# Altium schematic sheet Deneigus_Controle_Deplacement.SchDoc
size Tabloid; Date: Date; Author: Author 1; Revision: 1; Size: 11x17; Sheet_Name: Interface Déplacement
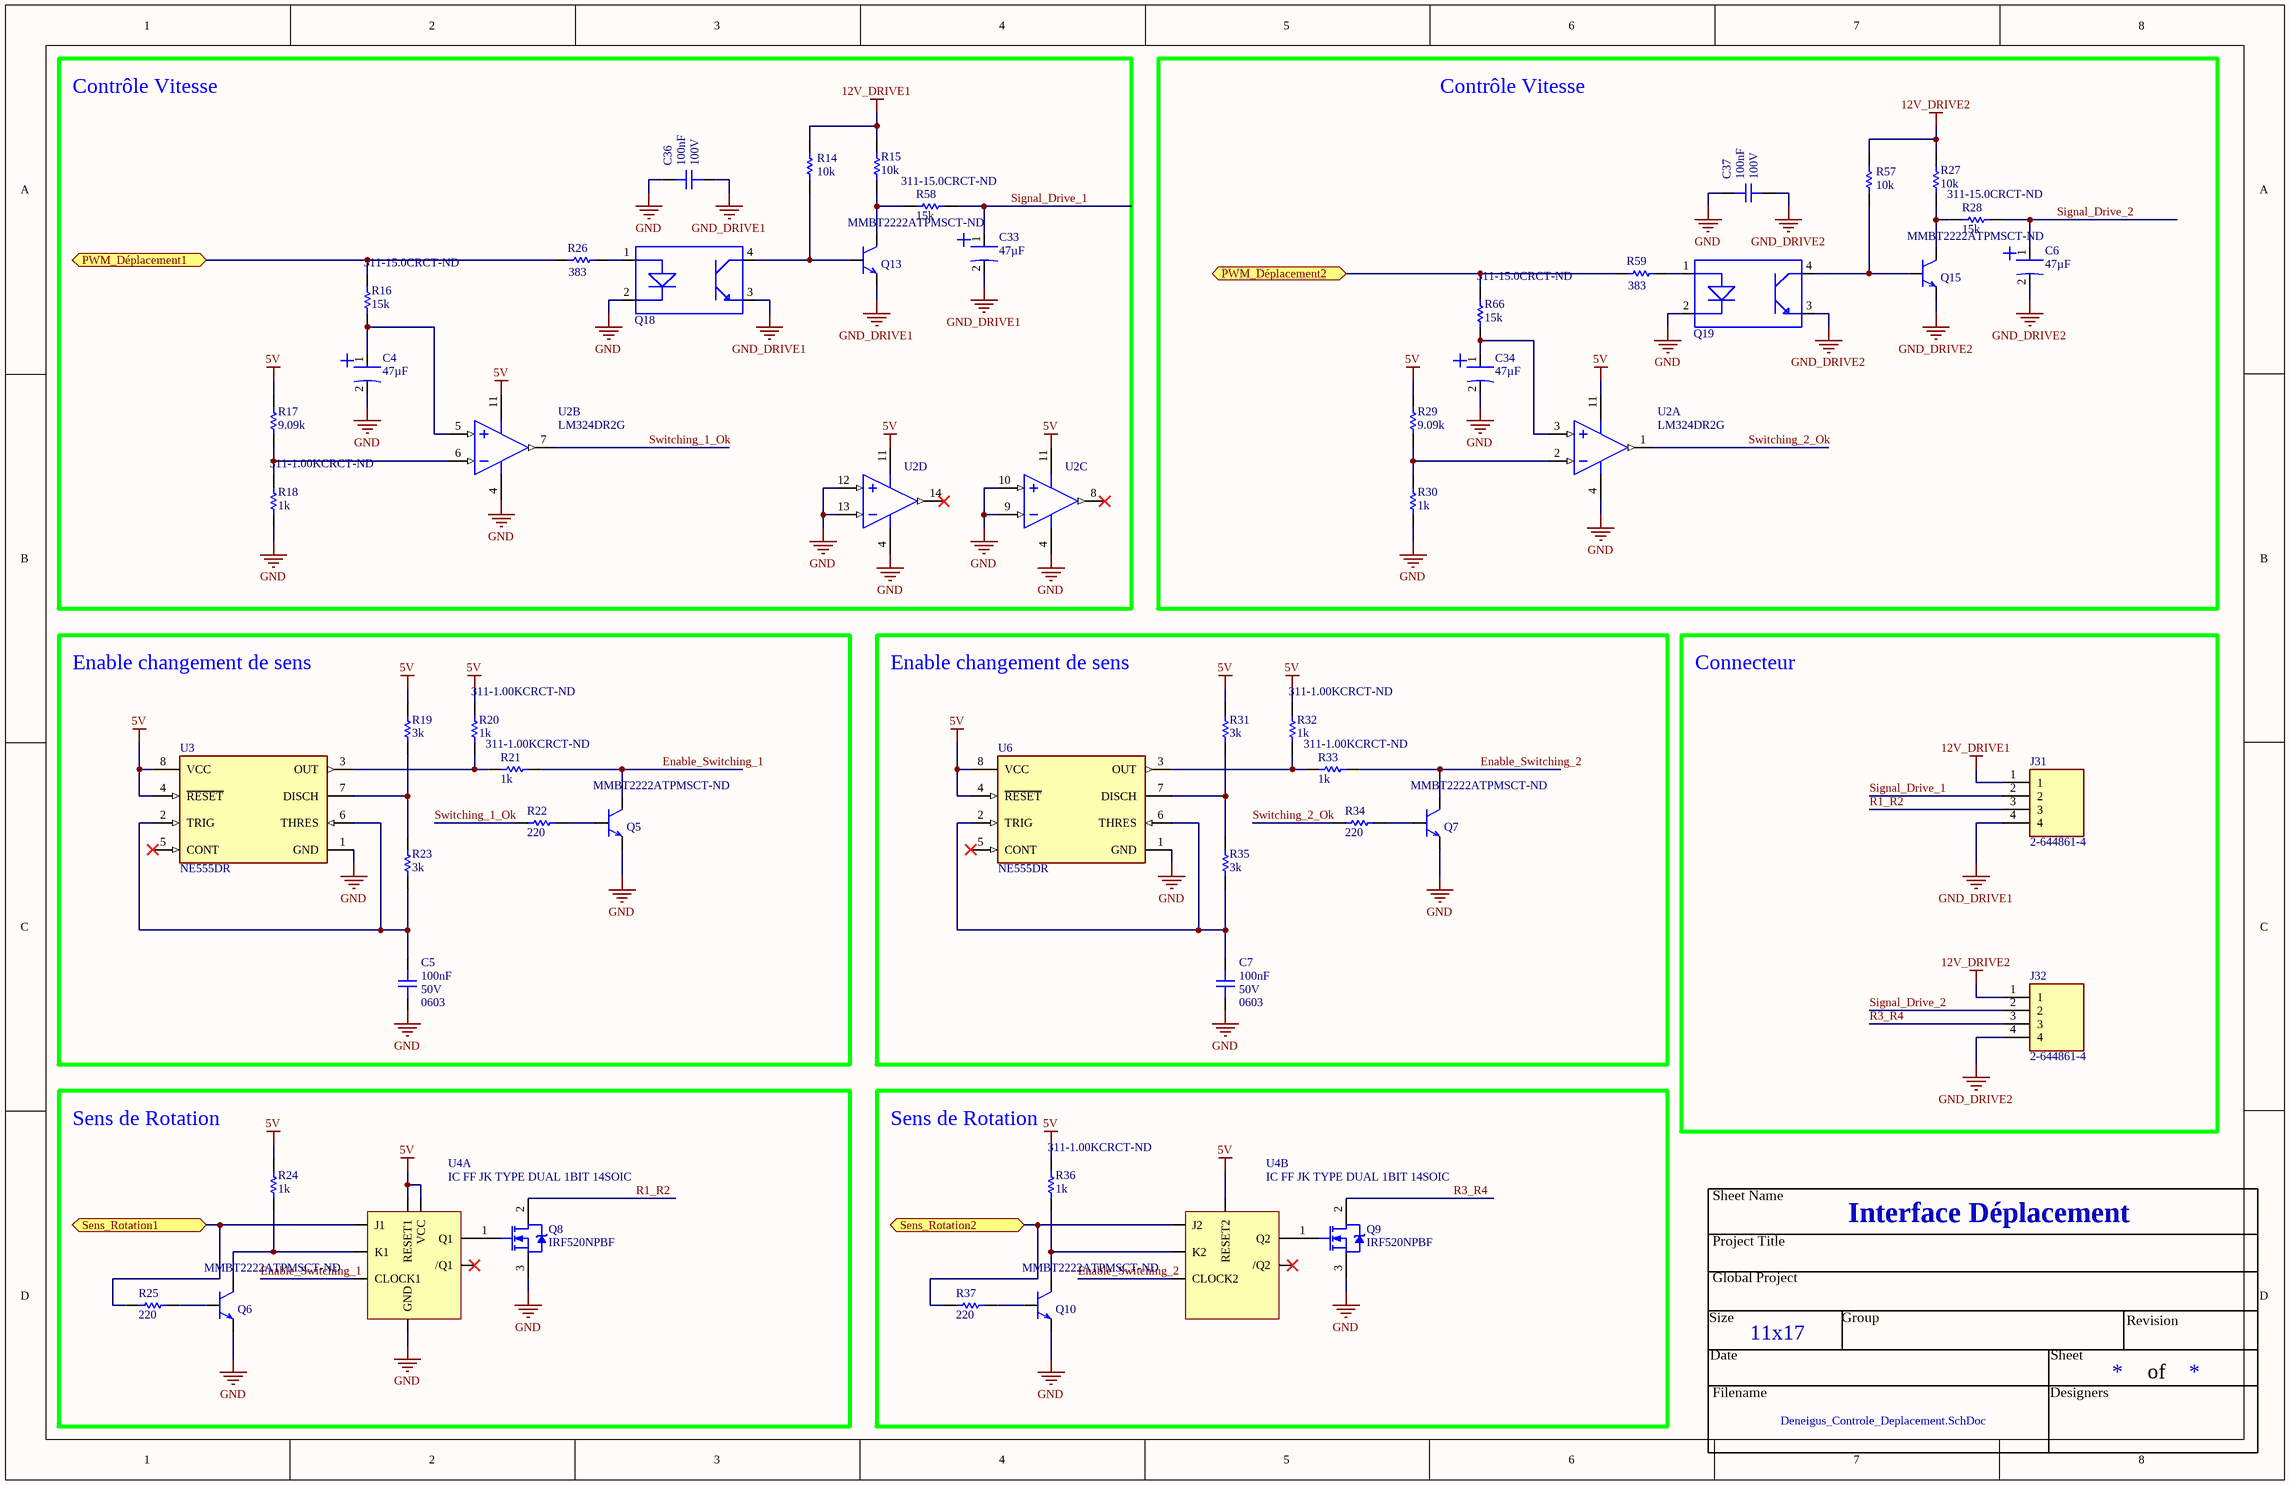
[diagram p0: Deneigus_Controle_Deplacement.SchDoc]

## Parts
C4  value 47µF  [47uF]  (hidden comment: CAP ALUM POLY 47UF 20% 16V SMD)
C5  value 100nF  Voltage: 50V  Package: 0603  [CAP_0603]  (hidden comment: CAP - 0603)
C6  value 47µF  [47uF]  (hidden comment: CAP ALUM POLY 47UF 20% 16V SMD)
C7  value 100nF  Voltage: 50V  Package: 0603  [CAP_0603]  (hidden comment: CAP - 0603)
C33  value 47µF  [47uF]  (hidden comment: CAP ALUM POLY 47UF 20% 16V SMD)
C34  value 47µF  [47uF]  (hidden comment: CAP ALUM POLY 47UF 20% 16V SMD)
C36  value 100nF  Voltage: 100V  [CAP_0805]  (hidden comment: CAP - 0805)
C37  value 100nF  Voltage: 100V  [CAP_0805]  (hidden comment: CAP - 0805)
J31  2-644861-4  [TE_2-644861-4]
J32  2-644861-4  [TE_2-644861-4]
Q5  Supplier Part Number 1: MMBT2222ATPMSCT-ND  [SOT-23]  (hidden comment: TRANS NPN 40V 0.2A SOT23)
Q6  Supplier Part Number 1: MMBT2222ATPMSCT-ND  [SOT-23]  (hidden comment: TRANS NPN 40V 0.2A SOT23)
Q7  Supplier Part Number 1: MMBT2222ATPMSCT-ND  [SOT-23]  (hidden comment: TRANS NPN 40V 0.2A SOT23)
Q8  IRF520NPBF  [INTR-TO-220AB-3]
Q9  IRF520NPBF  [INTR-TO-220AB-3]
Q10  Supplier Part Number 1: MMBT2222ATPMSCT-ND  [SOT-23]  (hidden comment: TRANS NPN 40V 0.2A SOT23)
Q13  Supplier Part Number 1: MMBT2222ATPMSCT-ND  [SOT-23]  (hidden comment: TRANS NPN 40V 0.2A SOT23)
Q15  Supplier Part Number 1: MMBT2222ATPMSCT-ND  [SOT-23]  (hidden comment: TRANS NPN 40V 0.2A SOT23)
Q18  WL-OCPT OPTOCOUPLER PHOTOTRANSIS  [WL-OCPT OPTOCOUPLER PHOTOTRANSIS]  (value not drawn)
Q19  WL-OCPT OPTOCOUPLER PHOTOTRANSIS  [WL-OCPT OPTOCOUPLER PHOTOTRANSIS]  (value not drawn)
R14  value 10k  [RES_0805]  (hidden comment: Res1)
R15  value 10k  [RES_0805]  (hidden comment: Res1)
R16  value 15k  Supplier Part Number 1: 311-15.0CRCT-ND  [RES_0805]  (hidden comment: Res1)
R17  value 9.09k  [RES_0805]  (hidden comment: Res1)
R18  value 1k  Supplier Part Number 1: 311-1.00KCRCT-ND  [RES_0805]  (hidden comment: Res1)
R19  value 3k  [RES_0805]  (hidden comment: Res1)
R20  value 1k  Supplier Part Number 1: 311-1.00KCRCT-ND  [RES_0805]  (hidden comment: Res1)
R21  value 1k  Supplier Part Number 1: 311-1.00KCRCT-ND  [RES_0805]  (hidden comment: Res1)
R22  value 220  [RES_0805]  (hidden comment: Res1)
R23  value 3k  [RES_0805]  (hidden comment: Res1)
R24  value 1k  [RES_0805]  (hidden comment: Res1)
R25  value 220  [RES_0805]  (hidden comment: Res1)
R26  value 383  [RES_0805]  (hidden comment: Res1)
R27  value 10k  [RES_0805]  (hidden comment: Res1)
R28  value 15k  Supplier Part Number 1: 311-15.0CRCT-ND  [RES_0805]  (hidden comment: Res1)
R29  value 9.09k  [RES_0805]  (hidden comment: Res1)
R30  value 1k  [RES_0805]  (hidden comment: Res1)
R31  value 3k  [RES_0805]  (hidden comment: Res1)
R32  value 1k  Supplier Part Number 1: 311-1.00KCRCT-ND  [RES_0805]  (hidden comment: Res1)
R33  value 1k  Supplier Part Number 1: 311-1.00KCRCT-ND  [RES_0805]  (hidden comment: Res1)
R34  value 220  [RES_0805]  (hidden comment: Res1)
R35  value 3k  [RES_0805]  (hidden comment: Res1)
R36  value 1k  Supplier Part Number 1: 311-1.00KCRCT-ND  [RES_0805]  (hidden comment: Res1)
R37  value 220  [RES_0805]  (hidden comment: Res1)
R57  value 10k  [RES_0805]  (hidden comment: Res1)
R58  value 15k  Supplier Part Number 1: 311-15.0CRCT-ND  [RES_0805]  (hidden comment: Res1)
R59  value 383  [RES_0805]  (hidden comment: Res1)
R66  value 15k  Supplier Part Number 1: 311-15.0CRCT-ND  [RES_0805]  (hidden comment: Res1)
U2  LM324DR2G  [ONSC-SOIC-14-751A-03_V]  (parts A,B,C,D of 4)
U3  NE555DR  [FP-D0008A-IPC_A]
U4  IC FF JK TYPE DUAL 1BIT 14SOIC  [SOIC127P600X175-14N]  (parts A,B of 2)
U6  NE555DR  [FP-D0008A-IPC_A]

## Blocks framed on the sheet
Contrôle Vitesse: C4 C33 C36 Q13 Q18 R14-R18 R26 R58 U2
Contrôle Vitesse: C6 C34 C37 Q15 Q19 R27-R30 R57 R59 R66 U2
Enable changement de sens: C5 Q5 R19-R23 U3
Enable changement de sens: C7 Q7 R31-R35 U6
Connecteur: J31 J32
Sens de Rotation: Q6 Q8 R24 R25 U4
Sens de Rotation: Q9 Q10 R36 R37 U4

## Ports
PWM_Déplacement1 (bidir), PWM_Déplacement2 (bidir), Sens_Rotation1 (bidir), Sens_Rotation2 (bidir)

## Nets
5V: R17.2 R19.2 R20.2 R24.2 R29.2 R31.2 R32.2 R36.2 U2.11(VEE/GND) U3.4(~{RESET}) U3.8(VCC) U4.2(RESET1) U4.4(VCC) U4.6(RESET2) U6.4(~{RESET}) U6.8(VCC)
12V_DRIVE1: J31.1 R14.1 R15.2
12V_DRIVE2: J32.1 R27.2 R57.1
GND: C4.2 C5.1 C7.1 C34.2 C36.2 C37.2 Q5.2 Q6.2 Q7.2 Q8.3(S) Q9.3(S) Q10.2 Q18.2 Q19.2 R18.1 R30.1 U2.4(VCC) U2.9(IN3-) U2.10(IN3+) U2.12(IN4+) U2.13(IN4-) U3.1(GND) U4.11(GND) U6.1(GND)
GND_DRIVE1: C33.2 C36.1 J31.4 Q13.2 Q18.3
GND_DRIVE2: C6.2 C37.1 J32.4 Q15.2 Q19.3
Enable_Switching_1: Q5.3 R21.2 U4.1(CLOCK1)
Enable_Switching_2: Q7.3 R33.2 U4.5(CLOCK2)
PWM_Déplacement1: R16.1 R26.1 ; port PWM_Déplacement1
PWM_Déplacement2: R59.1 R66.1 ; port PWM_Déplacement2
R1_R2: J31.3 Q8.2(D)
R3_R4: J32.3 Q9.2(D)
Sens_Rotation1: R25.1 U4.14(J1) ; port Sens_Rotation1
Sens_Rotation2: R37.1 U4.7(J2) ; port Sens_Rotation2
Signal_Drive_1: C33.1 J31.2 R58.2
Signal_Drive_2: C6.1 J32.2 R28.2
Switching_1_Ok: R22.1 U2.7(OUT2)
Switching_2_Ok: R34.1 U2.1(OUT1)
NetC4_1: C4.1 R16.2 U2.5(IN2+)
NetC5_2: C5.2 R23.1 U3.2(TRIG) U3.6(THRES)
NetC7_2: C7.2 R35.1 U6.2(TRIG) U6.6(THRES)
NetC34_1: C34.1 R66.2 U2.3(IN1+)
NetQ5_1: Q5.1 R22.2
NetQ6_1: Q6.1 R25.2
NetQ6_3: Q6.3 R24.1 U4.3(K1)
NetQ7_1: Q7.1 R34.2
NetQ8_1: Q8.1(G) U4.12(Q1)
NetQ9_1: Q9.1(G) U4.9(Q2)
NetQ10_1: Q10.1 R37.2
NetQ10_3: Q10.3 R36.1 U4.10(K2)
NetQ13_1: Q13.1 Q18.4 R14.2
NetQ13_3: Q13.3 R15.1 R58.1
NetQ15_1: Q15.1 Q19.4 R57.2
NetQ15_3: Q15.3 R27.1 R28.1
NetQ18_1: Q18.1 R26.2
NetQ19_1: Q19.1 R59.2
NetR17_1: R17.1 R18.2 U2.6(IN2-)
NetR19_1: R19.1 R23.2 U3.7(DISCH)
NetR20_1: R20.1 R21.1 U3.3(OUT)
NetR29_1: R29.1 R30.2 U2.2(IN1-)
NetR31_1: R31.1 R35.2 U6.7(DISCH)
NetR32_1: R32.1 R33.1 U6.3(OUT)

Not connected (* = marked no-connect by the designer): U2 8(OUT3)* 14(OUT4)*; U3 5(CONT)*; U4 8(/Q2)* 13(/Q1)*; U6 5(CONT)*

## Notes on the sheet
- Sheet Name
- Project Title
- Global Project
- Revision
- Size
- Date
- Group
- Sheet
- of
- Filename
- Designers

## Library data of the parts
C4 C6 C33 C34 = 47µF SMD: Mfg Part Number: 875105344006; Mfg: Würth Elektronik; Supplier 1: Digikey; Supplier Part Number 1: 732-6421-2-ND; HelpURL: https://www.we-online.de/katalog/datasheet/875105344006.pdf
C5 C7 = CAP - 0603: Precision: 10%; Current: *; CreatedBy: Jonathan Bouchard; Power: *
C36 C37 = CAP - 0805: Mfg Part Number: GRM21BR61H106ME43L; Mfg: Murata Electronics; Precision: 10%; Current: *; CreatedBy: Jonathan Bouchard; Power: *; Package: 0805; Supplier 1: Digi-Key; Supplier Part Number 1: 490-5825-1-ND
J31 J32 = 2-644861-4: Connector Header Through Hole 4 position 0.100 (2.54mm); MF: TE Connectivity; Availability: Good; Value: *; Check_prices: https://www.snapeda.com/parts/2-644861-4/TE%20Connectivity%20AMP%20Connectors/view-part/2876279/?ref=eda; Package: None; Price: None; MP: 2-644861-4; SnapEDA_Link: https://www.snapeda.com/parts/2-644861-4/TE%20Connectivity%20AMP%20Connectors/view-part/2876279/?ref=snap; Purchase-URL: https://pricing.snapeda.com/search/part/2-644861-4/?ref=eda
Q5-Q7 Q10 Q13 Q15 = NPN 3904 SMD: Transistor: 200mA 200mW NPN General-Purpose Amplifier, SOT-23, 7IN. Reel; Manufacturer: MCC; Manufacturer Part Number: MMBT3904-TP; Max Power Dissipation: 350mW; Number of Elements: 1; hFE Min: 40; Frequency: 300MHz; Collector Base Voltage (VCBO): 60V; Emitter Base Voltage (VEBO): 6V; Collector Emitter Saturation Voltage: 300mV; Element Configuration: Single; Current Rating: 100mA; RoHS: Yes; Category: BJTs; Stock 1: 949449; Pricing 1: 1=0.10000, 10=0.08100, 25=0.07680, 100=0.04400, 500=0.02706, 1000=0.01844 (USD); Mount: Surface Mount; Case/Package: SOT-23; Number of Pins: 3; Min Operating Temperature: -55°C; Max Operating Temperature: 150°C; Package Quantity: 1; Collector Emitter Voltage (VCEO): 40V; Packaging: Tape and Reel; Max Collector Current: 200mA; Transition Frequency: 300MHz; Collector Emitter Breakdown Voltage: 40V; Polarity: NPN; Max Breakdown Voltage: 40V; Power Dissipation: 350mW; Max Frequency: 300MHz; Gain Bandwidth Product: 300MHz; Voltage Rating (DC): 40V; Series: -; Collector-emitter Voltage-Max: 300mV; Length: 3.04mm; Width: 1.4mm; Height: 1.12mm; Radiation Hardening: No; Lead Free: Lead Free; RoHS Compliant: Yes; ComponentLink1URL: https://datasheet.ciiva.com/972/mmbt3904sot-23-972515.pdf?src-supplier=Digi-Key; ComponentLink1Description: https://datasheet.ciiva.com/972/mmbt3904sot-23-972515.pdf?src-supplier=Digi-Key; ComponentLink2URL: https://datasheet.ciiva.com/16291/mmbt3904sot-23-37005-16291911.pdf?src-supplier=Mouser; ComponentLink2Description: https://datasheet.ciiva.com/16291/mmbt3904sot-23-37005-16291911.pdf?src-supplier=Mouser; ComponentLink3URL: https://datasheet.ciiva.com/15139/getdatasheetpartid-251950-15139820.pdf?src-supplier=Verical; ComponentLink3Description: https://datasheet.ciiva.com/15139/getdatasheetpartid-251950-15139820.pdf?src-supplier=Verical; ComponentLink4URL: https://datasheet.ciiva.com/972/mmbt3904sot-23-972516.pdf?src-supplier=Digi-Key; ComponentLink4Description: https://datasheet.ciiva.com/972/mmbt3904sot-23-972516.pdf?src-supplier=Digi-Key; ComponentLink5URL: https://datasheet.ciiva.com/16742/mmbt3904tsot-523-16742101.pdf?src-supplier=Future+Electronics; ComponentLink5Description: https://datasheet.ciiva.com/16742/mmbt3904tsot-523-16742101.pdf?src-supplier=Future+Electronics; ComponentLink6URL: https://datasheet.ciiva.com/14546/70055699-14546053.pdf?src-supplier=Allied+Electronics; ComponentLink6Description: https://datasheet.ciiva.com/14546/70055699-14546053.pdf?src-supplier=Allied+Electronics; Supplier 1: Digi-Key
Q8 Q9 = CMP-013-00017-4: HEXFET(R) Power MOSFET, 100 V, 9.7 A, 0.2 Ohm, -55 to 175 degC, 3-Pin FM (TO-220AB), RoHS, Tube; Manufacturer: International Rectifier; Power: 48W; Elements: 1; Typical Rise Time: 23ns; Nominal Dual Supply Voltage: 100V; Rds On Max: 200mohm; Input Capacitance: 330pF; Nominal Vgs: 4V; Package Reference: TO-220AB; Max Operating Temperature: 175°C; Datasheet Version: Nov-03; Datasheet URL: http://www.infineon.com/dgdl/irf520npbf.pdf?fileId=5546d462533600a4015355e340711985; Package Quantity: 50; Package Description: 3-Pin Flange Mount, Body 4.445 x 10.415 mm, Pitch 2.54 mm; Pins: 3; Packaging: Rail/Tube; RoHS Compliant: True; Min Operating Temperature: -55°C; Case/Package: TO-220-3; Mounting Technology: TH
Q18 Q19 = WL-OCPT OPTOCOUPLER PHOTOTRANSIS: Optoisolator Transistor Output 3750Vrms 1 Channel 4-SOP; Supplier 1: Digi-Key; Supplier Part Number 1: 732-140357145400CT-ND
R14-R37 R57-R59 R66 = Res1: Resistor; Published: 8-Jun-2000; LatestRevisionDate: 17-Jul-2002; LatestRevisionNote: Re-released for DXP Platform.; PackageReference: AXIAL-0.3; Publisher: Altium Limited; PackageDescription: Axial Device, Thru-Hole; 2 Leads; 0.3 in Pin Spacing
  R16 R18 R20 R21 R28 R32 R33 R36 R58 R66: Supplier 1: Digi-Key
  R24: Supplier 1: Digi-Key; Supplier Part Number 1: RMCF0805FT1K00CT-ND
U2 = CMP-1310-00171-1: Single Supply Quad Operational Amplifier, 3 to 32 V, 0 to 70 degC, 14-Pin SOIC, Pb-Free, Tape and Reel; Manufacturer: On Semiconductor; VCC Max (V): 32; VCC Min (V): 3; PackageVersion: Rev. K, 05/2011; ComponentLink3URL: http://www.onsemi.com/pub_link/Collateral/751A-03.PDF; ComponentLink3Description: Package Specification; Packing: Tape and Reel; ComponentLink2URL: http://www.onsemi.cn/pub_link/Collateral/LM324-D.PDF; PackageReference: SOIC-14-751A-03; ComponentLink1URL: http://www.onsemi.com/; PackageDescription: 14-Pin Small Outline Integrated Circuit, Body 8.65 x 3.9 mm, Pitch 1.27 mm; ComponentLink1Description: Manufacturer URL; DatasheetVersion: Rev. 25; Mounting Technology: Surface Mount; RoHS: TRUE; ComponentLink2Description: Datasheet; PartNumber: LM324DR2G
U3 U6 = CMP-1685-00007-2: IC OSC SGL TIMER 100KHZ 8-SOIC; Low Level Output Current: 200mA; Quiescent Current: 15mA; Min Supply Voltage: 4.5V; Number of Timers/Counters: 1; Max Supply Voltage: 16V; Operating Supply Current: 10mA; High Level Output Current: -200mA; Packaging: Tape and Reel; Frequency: 100kHz; Weight: 0.002561oz; REACH SVHC: No SVHC; Package Quantity: 2500; Width: 3.91mm; Max Operating Temperature: 70°C; Contact Plating: Gold; Lead Free: Lead Free; Number of Pins: 8; Min Operating Temperature: 0°C; Radiation Hardening: No; Length: 4.9mm; Case/Package: SOIC; Height: 1.58mm; Mount: Surface Mount
U4 = Dual JK flip-flop: Flip Flop Element JK Type Bit Negative Edge 14-SOIC (0.154", 3.90mm Width); Supplier 1: Digi-Key; Supplier Part Number 1: 296-14540-1-ND